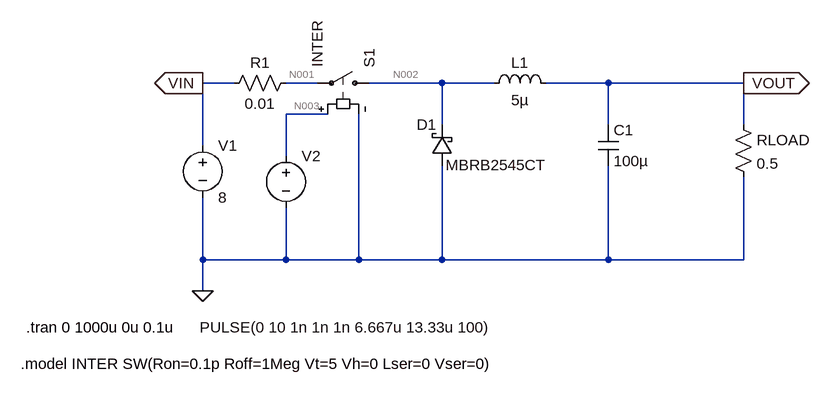
[diagram p0: schematic POE2025Week12StepDown_new.asc]
POE2025Week12StepDown_new.asc, the LTspice schematic file:
Version 4
SHEET 1 1312 680
WIRE 16 64 -32 64
WIRE 144 64 96 64
WIRE 336 64 224 64
WIRE 416 64 336 64
WIRE 592 64 496 64
WIRE 800 64 592 64
WIRE 160 112 96 112
WIRE 336 128 336 64
WIRE 592 128 592 64
WIRE 800 128 800 64
WIRE -32 160 -32 64
WIRE 96 176 96 112
WIRE -32 336 -32 240
WIRE 96 336 96 256
WIRE 96 336 -32 336
WIRE 208 336 208 112
WIRE 208 336 96 336
WIRE 336 336 336 192
WIRE 336 336 208 336
WIRE 592 336 592 192
WIRE 592 336 336 336
WIRE 800 336 800 208
WIRE 800 336 592 336
WIRE -32 384 -32 336
FLAG -32 384 0
FLAG 800 64 VOUT
IOPIN 800 64 Out
FLAG -32 64 VIN
IOPIN -32 64 Out
SYMBOL voltage -32 144 R0
WINDOW 123 0 0 Left 2
WINDOW 39 0 0 Left 2
SYMATTR InstName V1
SYMATTR Value 8
SYMBOL voltage 96 160 R0
WINDOW 3 -133 280 Left 2
WINDOW 123 0 0 Left 2
WINDOW 39 0 0 Left 2
SYMATTR Value PULSE(0 10 1n 1n 1n 6.667u 13.33u 100)
SYMATTR InstName V2
SYMBOL ind 400 80 R270
WINDOW 0 32 56 VTop 2
WINDOW 3 5 56 VBottom 2
SYMATTR InstName L1
SYMATTR Value 5µ
SYMBOL cap 576 128 R0
SYMATTR InstName C1
SYMATTR Value 100µ
SYMBOL res 784 112 R0
SYMATTR InstName RLOAD
SYMATTR Value 0.5
SYMBOL schottky 352 192 R180
WINDOW 0 24 64 Left 2
WINDOW 3 -145 2 Left 2
SYMATTR InstName D1
SYMATTR Value MBRB2545CT
SYMBOL sw 240 64 M270
SYMATTR InstName S1
SYMATTR Value INTER
SYMBOL res 112 48 R90
WINDOW 0 0 56 VBottom 2
WINDOW 3 32 56 VTop 2
SYMATTR InstName R1
SYMATTR Value 0.01
TEXT -304 440 Left 2 !.tran 0 1000u 0u 0.1u
TEXT -312 496 Left 2 !.model INTER SW(Ron=0.1p Roff=1Meg Vt=5 Vh=0 Lser=0 Vser=0)

The netlist it stands for:
* POE2025Week12StepDown_new.asc
V1 VIN 0 8
V2 N003 0 PULSE(0 10 1n 1n 1n 6.667u 13.33u 100)
L1 N002 VOUT 5µ
C1 VOUT 0 100µ
RLOAD VOUT 0 0.5
D1 0 N002 MBRB2545CT
S1 N002 N001 N003 0 INTER
R1 N001 VIN 0.01
.model D D
.lib standard.dio
.tran 0 1000u 0u 0.1u
.model INTER SW(Ron=0.1p Roff=1Meg Vt=5 Vh=0 Lser=0 Vser=0)
.backanno
.end

* Results of the author's LTspice run, read from the files saved beside the schematic
* Operating Point, zero values left out:
*   V(vout) = 4 µV
*   V(n001) = 8 V
*   V(vin) = 8 V
*   V(n002) = 4.008 µV
*   I(V1) = -8 µA
*   I(RLOAD) = 8 µA
*   I(L1) = 8 µA
*   I(D1) = -4.101 pA
*   I(R1) = -8 µA
*   I(S1) = 8 µA
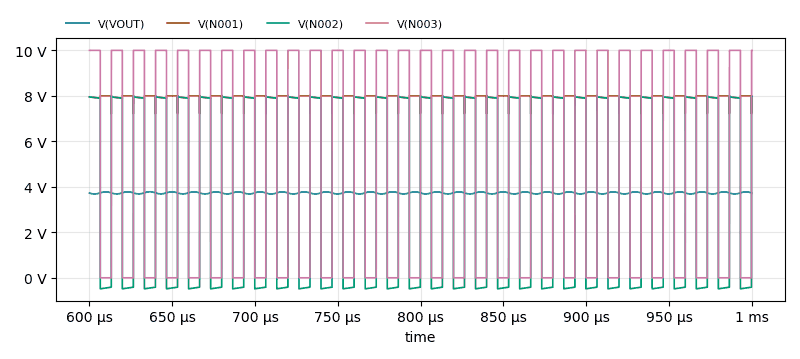
[diagram p1: Transient Analysis of POE2025Week12StepDown_new.asc, plotted from the saved traces]
* Transient Analysis, 1 run:
*   V(VOUT): min 3.685 V, max 3.782 V, average 3.733 V, rms 3.733 V, last 3.724 V
*   V(N001): min 7.214 V, max 8.012 V, average 7.963 V, rms 7.963 V, last 7.951 V
*   V(N002): min -483.8 mV, max 8.012 V, average 3.741 V, rms 5.615 V, last 7.951 V
*   V(N003): min 0 V, max 10 V, average 5.004 V, rms 7.073 V, last 10 V